# Altium schematic sheet STLink_V3E_PWR.SchDoc: STLINK V3E PWR
size A4; Project: STM32H7-DK; Date: Not used; ApprovedBy: Not used; CheckedBy: Not used; Author: Not used; CompanyName: STMicroelectronics; DrawnBy: Not used; Engineer: Not used; Organization: Not used; Address1: Not used; Address2: Not used; Address3: Not used; Address4: Not used; DocumentNumber: Not used; Revision: Not used; SheetNumber: 16; SheetTotal: 16; CurrentTime: Not used; CurrentDate: Not used; Time: Not used; DocumentFullPathAndName: Not used; DocumentName: Not used; ModifiedDate: Not used; ImagePath: Not used; ProjectName: Not used; Application_BuildNumber: Not used
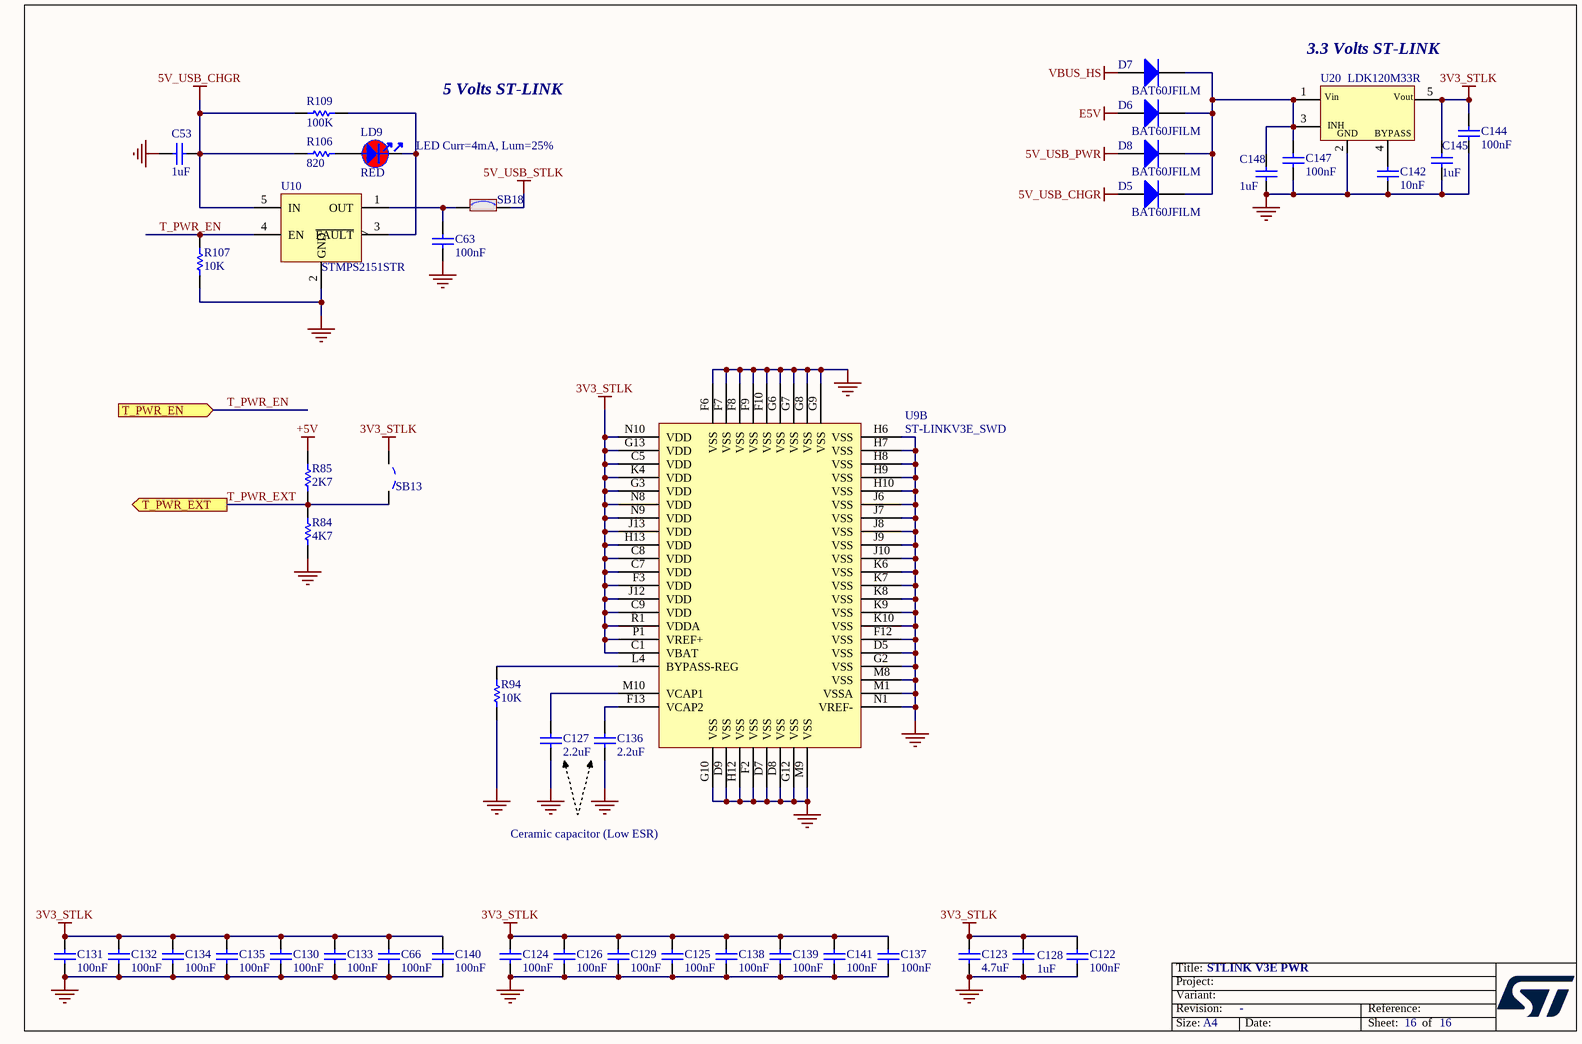
[diagram p0: STLink_V3E_PWR.SchDoc]

## Parts
C53  1uF  [0603C]
C63  100nF  [0603C]
C66  100nF  [0402C]
C122  100nF  [0603C]
C123  4.7uF  [0603C]
C124  100nF  [0402C]
C125  100nF  [0402C]
C126  100nF  [0402C]
C127  2.2uF  [1206C]
C128  1uF  [0603C]
C129  100nF  [0402C]
C130  100nF  [0402C]
C131  100nF  [0402C]
C132  100nF  [0402C]
C133  100nF  [0402C]
C134  100nF  [0402C]
C135  100nF  [0402C]
C136  2.2uF  [1206C]
C137  100nF  [0402C]
C138  100nF  [0402C]
C139  100nF  [0402C]
C140  100nF  [0402C]
C141  100nF  [0402C]
C142  10nF  [0603C]
C144  100nF  [0603C]
C145  1uF  [0603C]
C147  100nF  [0603C]
C148  1uF  [0603C]
D5  BAT60JFILM  [SOD-323]
D6  BAT60JFILM  [SOD-323]
D7  BAT60JFILM  [SOD-323]
D8  BAT60JFILM  [SOD-323]
LD9  value RED  [0603D]  (hidden comment: LED_red)
R84  4K7  [0402R]
R85  2K7  [0402R]
R94  10K  [0402R]
R106  820  [0603R]
R107  10K  [0603R]
R109  100K  [0402R]
SB13  Solder Bridge OFF  [SB_0603]  (value not drawn)
SB18  Solder Bridge ON  [SB_0603]  (value not drawn)
U9  ST-LINKV3E_SWD  [BGA176_0R65_10x10]  (part B of 2)
U10  STMPS2151STR  [SOT23-5]
U20  LDK120M33R  [SOT23-5]

## Ports
T_PWR_EN (in), T_PWR_EXT (out)

## Nets
3V3_STLK: C66.2 C122.2 C123.2 C124.2 C125.2 C126.2 C128.2 C129.2 C130.2 C131.2 C132.2 C133.2 C134.2 C135.2 C137.2 C138.2 C139.2 C140.2 C141.2 C144.2 C145.2 SB13.1 U9.C1(VBAT) U9.C5(VDD) U9.C7(VDD) U9.C8(VDD) U9.C9(VDD) U9.F3(VDD) U9.G3(VDD) U9.G13(VDD) U9.H13(VDD) U9.J12(VDD) U9.J13(VDD) U9.K4(VDD) U9.N8(VDD) U9.N9(VDD) U9.N10(VDD) U9.P1(VREF+) U9.R1(VDDA) U20.5(Vout)
5V_USB_CHGR: C53.1 D5.1(A) R106.1 R109.2 U10.5(IN)
5V_USB_PWR: D8.1(A)
5V_USB_STLK: SB18.2
+5V: R85.2
E5V: D6.1(A)
GND: C53.2 C63.1 C66.1 C122.1 C123.1 C124.1 C125.1 C126.1 C127.1 C128.1 C129.1 C130.1 C131.1 C132.1 C133.1 C134.1 C135.1 C136.1 C137.1 C138.1 C139.1 C140.1 C141.1 C142.1 C144.1 C145.1 C147.1 C148.2 R84.1 R94.1 R107.1 U9.D5(VSS) U9.D7(VSS) U9.D8(VSS) U9.D9(VSS) U9.F2(VSS) U9.F6(VSS) U9.F7(VSS) U9.F8(VSS) U9.F9(VSS) U9.F10(VSS) U9.F12(VSS) U9.G2(VSS) U9.G6(VSS) U9.G7(VSS) U9.G8(VSS) U9.G9(VSS) U9.G10(VSS) U9.G12(VSS) U9.H6(VSS) U9.H7(VSS) U9.H8(VSS) U9.H9(VSS) U9.H10(VSS) U9.H12(VSS) U9.J6(VSS) U9.J7(VSS) U9.J8(VSS) U9.J9(VSS) U9.J10(VSS) U9.K6(VSS) U9.K7(VSS) U9.K8(VSS) U9.K9(VSS) U9.K10(VSS) U9.M1(VSSA) U9.M8(VSS) U9.M9(VSS) U9.N1(VREF-) U10.2(GND) U20.2(GND)
VBUS_HS: D7.1(A)
T_PWR_EN: R107.2 U10.4(EN) ; port T_PWR_EN
T_PWR_EXT: R84.2 R85.1 SB13.2 ; port T_PWR_EXT
NetC63_2: C63.2 SB18.1 U10.1(OUT)
NetC127_2: C127.2 U9.M10(VCAP1)
NetC136_2: C136.2 U9.F13(VCAP2)
NetC142_2: C142.2 U20.4(BYPASS)
NetC147_2: C147.2 C148.1 D5.2(K) D6.2(K) D7.2(K) D8.2(K) U20.1(Vin) U20.3(CE)
NetLD9_1: LD9.1 R106.2
NetLD9_2: LD9.2 R109.1 U10.3(~{FAULT})
NetR94_2: R94.2 U9.L4(BYPASS-REG)

## Notes on the sheet
- 5 Volts ST-LINK
- (near U20) 3.3 Volts ST-LINK
- (near LD9) LED Curr=4mA, Lum=25%
- Ceramic capacitor (Low ESR)
- Title:
- Project:
- Size:
- Revision:
- Variant:
- A4
- -
- Date:
- Reference:
- Sheet:
- of
- (in symbol MCD-00086) INH

## Library data of the parts
C53 C128 C145 = MCD-00010: Capacitor,1uF,16V,X5R,10%,0603; Manufacturer_Part_Number: CC0603KRX5R7BB105; Manufacturer: YAGEO; Provided_By: Subcon; Initial_Board_Reference: mb1274; Internal_Part_Number: MCD-00010; Value: 1uF; Status: Released; Package: 0603; ComponentLink1Description: Yageo_Capacitor_X5R-series.pdf; ECCN_US: n/a; ECCN_EU: n/a; Part_Type: Capacitor
C63 = MCD-00006: Capacitor, MLCC, 100nF, 16V, X7R, 10%, 0402, T=0.5mm; Manufacturer_Part_Number: CC0402KRX7R7BB104; Manufacturer: YAGEO; Provided_By: Subcon; Initial_Board_Reference: MB1274; Internal_Part_Number: MCD-00006; Value: 100nF; Status: Released; Package: C0402; ComponentLink1Description: Yageo_Capacitor_X7R-series.pdf; ECCN_US: n/a; ECCN_EU: n/a; Part_Type: Capacitor; ComponentLink1URL: http://tunmcdsvn.tun.st.com/Component_Datasheet_Library/Trunk/Capacitors/Yageo_Multilayer_Capacitor_X7R_series_100pF_to_22uF
C66 C124-C126 C129-C135 C137-C141 = MCD-00102: Capacitor,100nF,16V,X7R,10%,0402; Manufacturer_Part_Number: CC0402KRX7R7BB104; Manufacturer: YAGEO; Provided_By: Subcon; Initial_Board_Reference: mb1262; Internal_Part_Number: MCD-00102; Value: 100nF; Status: Released; Package: 0402; ComponentLink1Description: Capacitor_X7R_100pF_to_22uF.pdf; ECCN_US: n/a; ECCN_EU: n/a; Part_Type: Capacitor
C122 C144 C147 = MCD-00211: Capacitor,100nF,16V,X7R,10%,0603; Manufacturer_Part_Number: CC0603KRX7R7BB104; Manufacturer: YAGEO; Provided_By: Subcon; Initial_Board_Reference: mb1319; Internal_Part_Number: MCD-00211; Value: 100nF; Status: Released; Package: 0603; ComponentLink1Description: Yageo_Capacitor_X7R-series.pdf; ECCN_US: n/a; ECCN_EU: n/a; Part_Type: Capacitor
C123 = MCD-00009: Capacitor,4.7uF,16V, X5R,10%,0603; Manufacturer_Part_Number: CC0603KRX5R7BB475; Manufacturer: YAGEO; Provided_By: subcon; Initial_Board_Reference: mb1274; Internal_Part_Number: MCD-00009; Value: 4.7uF; Status: Released; Part_Type: Capacitor; Package: 0603; ComponentLink1Description: Yageo_Capacitor_X5R-series.pdf; ECCN_US: n/a; ECCN_EU: n/a
C127 C136 = MCD-00008: Capacitor,2.2uF,16V, X7R,10%,1206; Manufacturer_Part_Number: CC1206KKX7R7BB225; Manufacturer: YAGEO; Alternate_Manufacturer_Part_Number: C1206C225K4RAC; Alternate_Manufacturer: KEMET; Provided_By: Subcon; Initial_Board_Reference: mb1274; Internal_Part_Number: MCD-00008; Value: 2.2uF; Status: Released; Package: 1206; ComponentLink1Description: Yageo_Capacitor_X7R-series.pdf; ECCN_US: n/a; ECCN_EU: n/a; Part_Type: Capacitor
C142 = MCD-00017: Capacitor,10nF,50V,X7R,10%,0603; Manufacturer_Part_Number: CC0603KRX7R9BB103; Manufacturer: YAGEO; Provided_By: Subcon; Initial_Board_Reference: mb1274; Internal_Part_Number: MCD-00017; Value: 10nF; Status: Released; Package: 0603; ComponentLink1Description: Yageo_Capacitor_X7R-series.pdf; ECCN_US: n/a; ECCN_EU: n/a; Part_Type: Capacitor
C148 = MCD-00238: Capacitor,1uF,6V3,X5R,10%,0603; Manufacturer_Part_Number: CC0603KRX5R5BB105; Manufacturer: YAGEO; Provided_By: Subcon; Initial_Board_Reference: mb1319; Internal_Part_Number: MCD-00238; Value: 1uF; Status: Released; Part_Type: Capacitor; Package: 0603; ComponentLink1Description: Yageo_Capacitor_X5R-series.pdf; ECCN_US: n/a; ECCN_EU: n/a
D5-D8 = MCD-00034: Manuf_1: STM; ECCN_US/EU: EAR99/NEC; Fitted: YES; Initial_Board_Reference: mb1274; Internal_Part_Number: MCD-00034; Value: BAT60JFILM; Status: Released; Manuf_Part_1: BAT60JFILM; ComponentLink1Description: STM_Diode_BAT60JFILM-SOD323.pdf; Ordered by: STM
LD9 = MCD-00587: LED Red, 0603 SMD, 2V Forward Voltage; Part_Type: Display; Manufacturer_Part_Number: VLMS1300-GS08; Manufacturer: VISHAY; Alternate_Manufacturer_Part_Number: LS Q976-NR-1; Alternate_Manufacturer: OSRAM OPTO SEMICONDUCTORS; Provided_By: Subcon; Initial_Board_Reference: MB1331; Internal_Part_Number: MCD-00587; Status: Footprint available; ComponentLink1Description: VISHAY_LED_RED_VLMS1300-GS08.pdf; ComponentLink1URL: http://tunmcdsvn.tun.st.com/Component_Datasheet_Library/Trunk/display/VISHAY_LED_RED_VLMS1300-GS08; Order_Code_Digikey: VLMS1300-GS08CT-ND; Order_Code_Farnell: 2078728; Package: LED 0603; ECCN_US: n/a; ECCN_EU: n/a
R84 = MCD-00065: Resistor,4K7,0402,1%,1/16W; Manufacturer_Part_Number: RC0402FR-074K7L; Manufacturer: YAGEO; Alternate_Manufacturer_Part_Number: RT0402FRE074K7L; Provided_By: Subcon; Initial_Board_Reference: mb1274; Internal_Part_Number: MCD-00065; Value: 4K7; Status: Released; ComponentLink1Description: Yageo_Resistor_RC0402-series.pdf; ECCN_US: n/a; ECCN_EU: n/a; Alternate_Manufacturer: YAGEO; Part_Type: Resistor
R85 = MCD-00055: Resistor,2K7,0402,1%,1/16W; Manufacturer_Part_Number: RC0402FR-072K7L; Manufacturer: YAGEO; Provided_By: Subcon; Initial_Board_Reference: mb1274; Internal_Part_Number: MCD-00055; Value: 2K7; Status: Released; ComponentLink1Description: Yageo_Resistor_RC0402-series.pdf; ECCN_US: n/a; ECCN_EU: n/a; Part_Type: Resistor
R94 = MCD-00053: Resistor,10K,0402,1%,1/16W; Manufacturer_Part_Number: RC0402FR-0710KL; Manufacturer: YAGEO; Provided_By: subcon; Initial_Board_Reference: mb1274; Internal_Part_Number: MCD-00053; Value: 10K; Status: Released; ComponentLink1Description: Yageo_Resistor_RC0402-series.pdf; ECCN_US: n/a; ECCN_EU: n/a; Part_Type: Resistor
R106 = MCD-00527: Resistor,820R,0402,1%,1/16W; Manufacturer_Part_Number: RC0402FR-07820RL; Manufacturer: YAGEO; Provided_By: Subcon; Internal_Part_Number: MCD-00527; Value: 820; Status: Released; Part_Type: Resistor; Package: R0402; ComponentLink1Description: Yageo_Resistor_RC0402-series.pdf; ComponentLink1URL: http://tunmcdsvn.tun.st.com/Component_Datasheet_Library/Trunk/Resistors/Yageo_Resistor_RC0402-series; ECCN_US: n/a; ECCN_EU: n/a
R107 = MCD-00053: Resistor,10K,0402,1%,1/16W; Manufacturer_Part_Number: RC0402FR-0710KL; Manufacturer: YAGEO; Provided_By: subcon; Initial_Board_Reference: MB1274; Internal_Part_Number: MCD-00053; Value: 10K; Status: Released; ComponentLink1Description: Yageo_Resistor_RC0402-series.pdf; ECCN_US: n/a; ECCN_EU: n/a; Part_Type: Resistor; Package: R0402; ComponentLink1URL: http://tunmcdsvn.tun.st.com/Component_Datasheet_Library/Trunk/Resistors/Yageo_Resistor_RC0402-series
R109 = MCD-00059: Resistor,100K,0402,1%,1/16W; Manufacturer_Part_Number: RC0402FR-07100KL; Manufacturer: YAGEO; Alternate_Manufacturer_Part_Number: RT0402FRE07100KL; Provided_By: Subcon; Initial_Board_Reference: mb1274; Internal_Part_Number: MCD-00059; Value: 100K; Status: Released; ComponentLink1Description: Yageo_Resistor_RC0402-series.pdf; ECCN_US: n/a; ECCN_EU: n/a; Alternate_Manufacturer: YAGEO; Part_Type: Resistor
SB13 = SB_OFF: Fitted: NO; Ordered by: Subcon; Revision: July-2002: Re-released for DXP Platform.; ECCN_US/EU: n/a
SB18 = SB_ON: Fitted: YES; Ordered by: Subcon; Revision: July-2002: Re-released for DXP Platform.; ECCN_US/EU: n/a
U9 = ST-LINKV3E_SWD: STM32F723IEK  (STM32F7 LittleBirdie) BGA176; Internal_Part_Number: MCD-00596; Manuf_Part_1: STM32F723IEK6; Manuf_1: STM; Initial_Board_Reference: mb1331; Fitted: YES; ECCN_US/EU: 3A991A2/NEC; Value: ST-LINKV3E_SWD; ComponentLink1Description: BGA176+25L_10x10x0.6_pitch0.65.pdf; ComponentLink1URL: http://tunmcdsvn.tun.st.com/Component_Datasheet_Library/Trunk/IC/BGA176+25L_10x10x0.6_pitch0.65.pdf; Ordered by: STM
U10 = MCD-00159: 500mA, Enhanced single channel power switches with active high enable pin; Part_Type: IC; Manufacturer: STMICROELECTRONICS; ECCN_US: EAR99; ECCN_EU: NEC; Provided_By: Subcon; Initial_Board_Reference: MB1264; Internal_Part_Number: MCD-00159; Value: STMPS2151STR; Status: Footprint available; Manufacturer_Part_Number: STMPS2151STR; ComponentLink1Description: STM_PWR-Switch_STMPS2151STR.pdf; ComponentLink1URL: http://tunmcdsvn.tun.st.com/Component_Datasheet_Library/Trunk/IC/STM_PWR-Switch_STMPS2151STR
U20 = MCD-00086: Ultra low drop-low noise BiCMOS voltage, regulators low ESR capacitors compatible; Manuf_1: STM; ECCN_US/EU: EAR99/NEC; Fitted: YES; Initial_Board_Reference: mb1248; Internal_Part_Number: MCD-00086; Value: LDK120M33R; Status: Released; Manuf_Part_1: LDK120M33R; ComponentLink1Description: STM_LDO_LD3985.pdf; Ordered by: STM